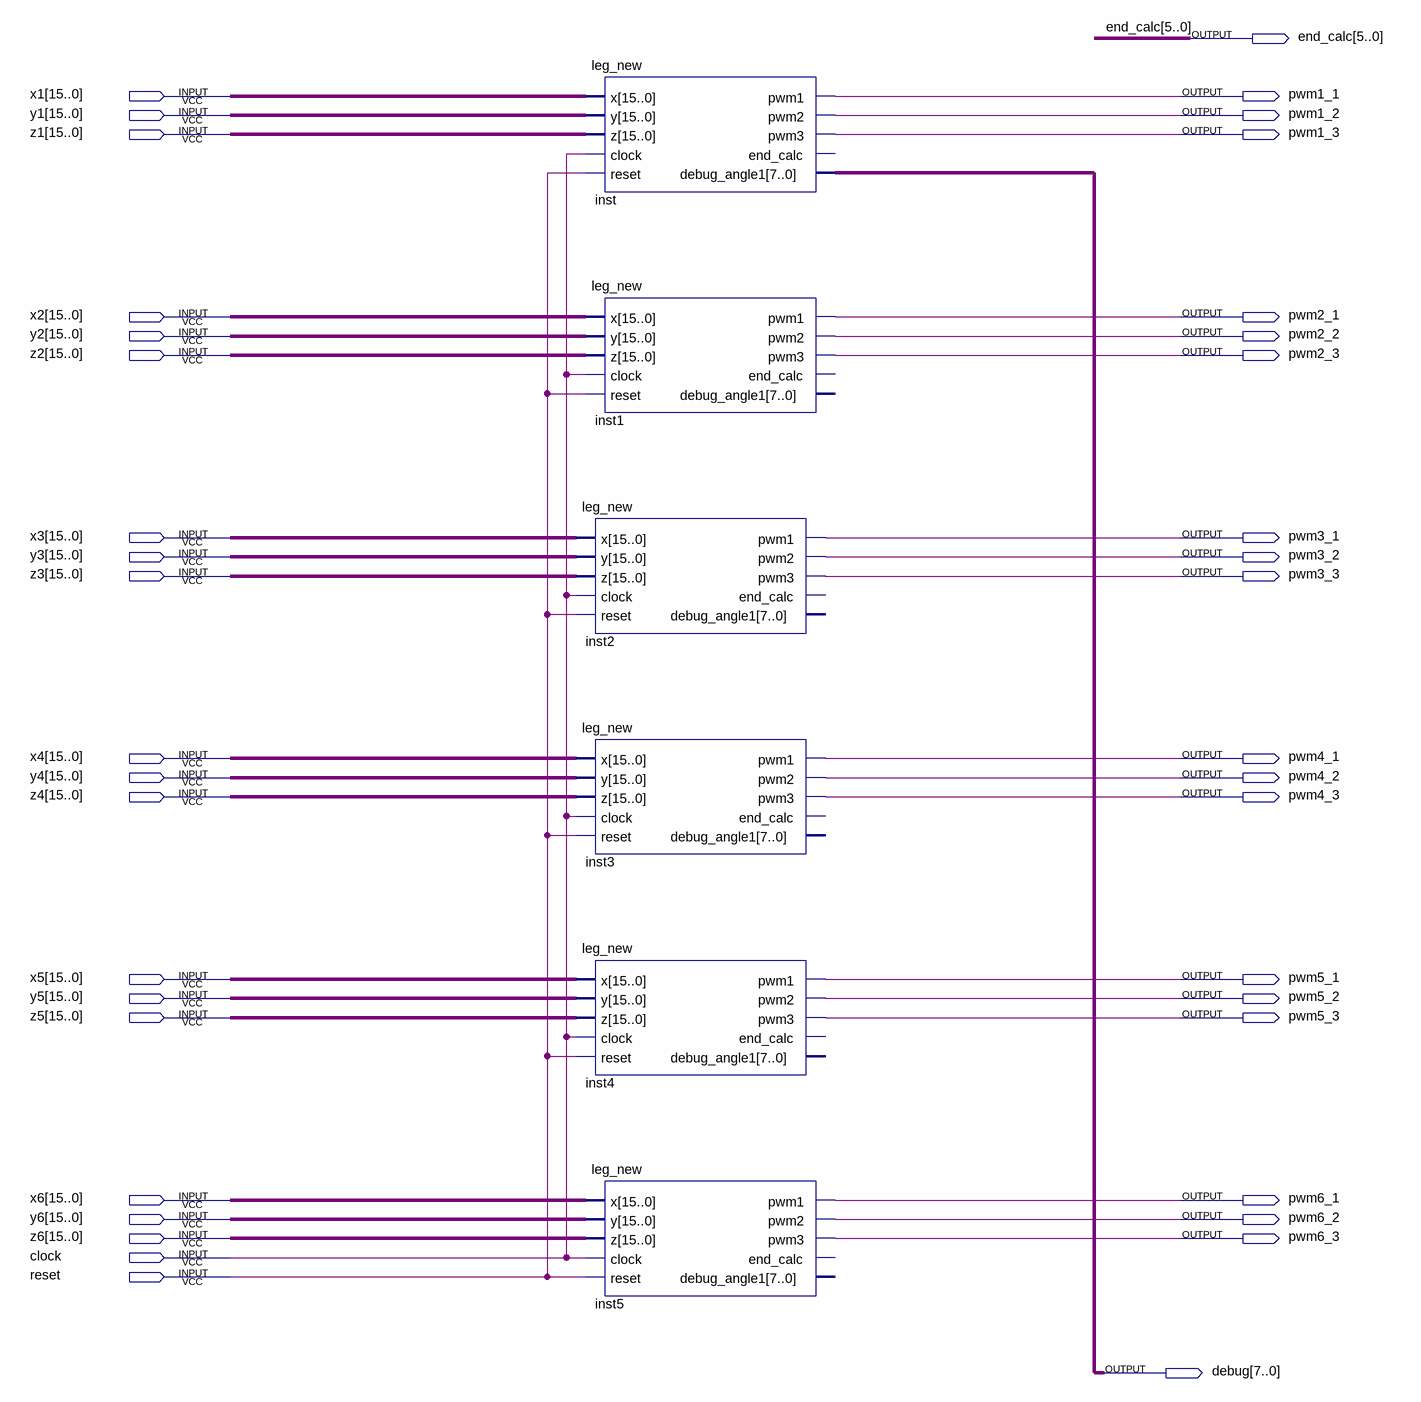
[diagram p0: schematic sheet]
// Quartus schematic full_bot_new.bdf as structural Verilog: 6 symbols, 40 pins
module full_bot_new (
  input  [15:0] x1,
  input  [15:0] y1,
  input  [15:0] z1,
  input  [15:0] x2,
  input  [15:0] y2,
  input  [15:0] z2,
  input  [15:0] x3,
  input  [15:0] y3,
  input  [15:0] z3,
  input  [15:0] x4,
  input  [15:0] y4,
  input  [15:0] z4,
  input  [15:0] x5,
  input  [15:0] y5,
  input  [15:0] z5,
  input  [15:0] x6,
  input  [15:0] y6,
  input  [15:0] z6,
  input  clock,
  input  reset,
  output [5:0] end_calc,
  output pwm1_1,
  output pwm1_2,
  output pwm1_3,
  output pwm2_1,
  output pwm2_2,
  output pwm2_3,
  output pwm3_1,
  output pwm3_2,
  output pwm3_3,
  output pwm4_1,
  output pwm4_2,
  output pwm4_3,
  output pwm5_1,
  output pwm5_2,
  output pwm5_3,
  output pwm6_1,
  output pwm6_2,
  output pwm6_3,
  output [7:0] debug
);

  leg_new inst (
    .x(x1), .y(y1), .z(z1), .clock(clock), .reset(reset), .pwm1(pwm1_1), .pwm2(pwm1_2), .pwm3(pwm1_3),
    .debug_angle1(debug));  // open: end_calc
  leg_new inst1 (
    .x(x2), .y(y2), .z(z2), .clock(clock), .reset(reset), .pwm1(pwm2_1), .pwm2(pwm2_2), .pwm3(pwm2_3));  // open: end_calc, debug_angle1
  leg_new inst2 (
    .x(x3), .y(y3), .z(z3), .clock(clock), .reset(reset), .pwm1(pwm3_1), .pwm2(pwm3_2), .pwm3(pwm3_3));  // open: end_calc, debug_angle1
  leg_new inst3 (
    .x(x4), .y(y4), .z(z4), .clock(clock), .reset(reset), .pwm1(pwm4_1), .pwm2(pwm4_2), .pwm3(pwm4_3));  // open: end_calc, debug_angle1
  leg_new inst4 (
    .x(x5), .y(y5), .z(z5), .clock(clock), .reset(reset), .pwm1(pwm5_1), .pwm2(pwm5_2), .pwm3(pwm5_3));  // open: end_calc, debug_angle1
  leg_new inst5 (
    .x(x6), .y(y6), .z(z6), .clock(clock), .reset(reset), .pwm1(pwm6_1), .pwm2(pwm6_2), .pwm3(pwm6_3));  // open: end_calc, debug_angle1
endmodule
